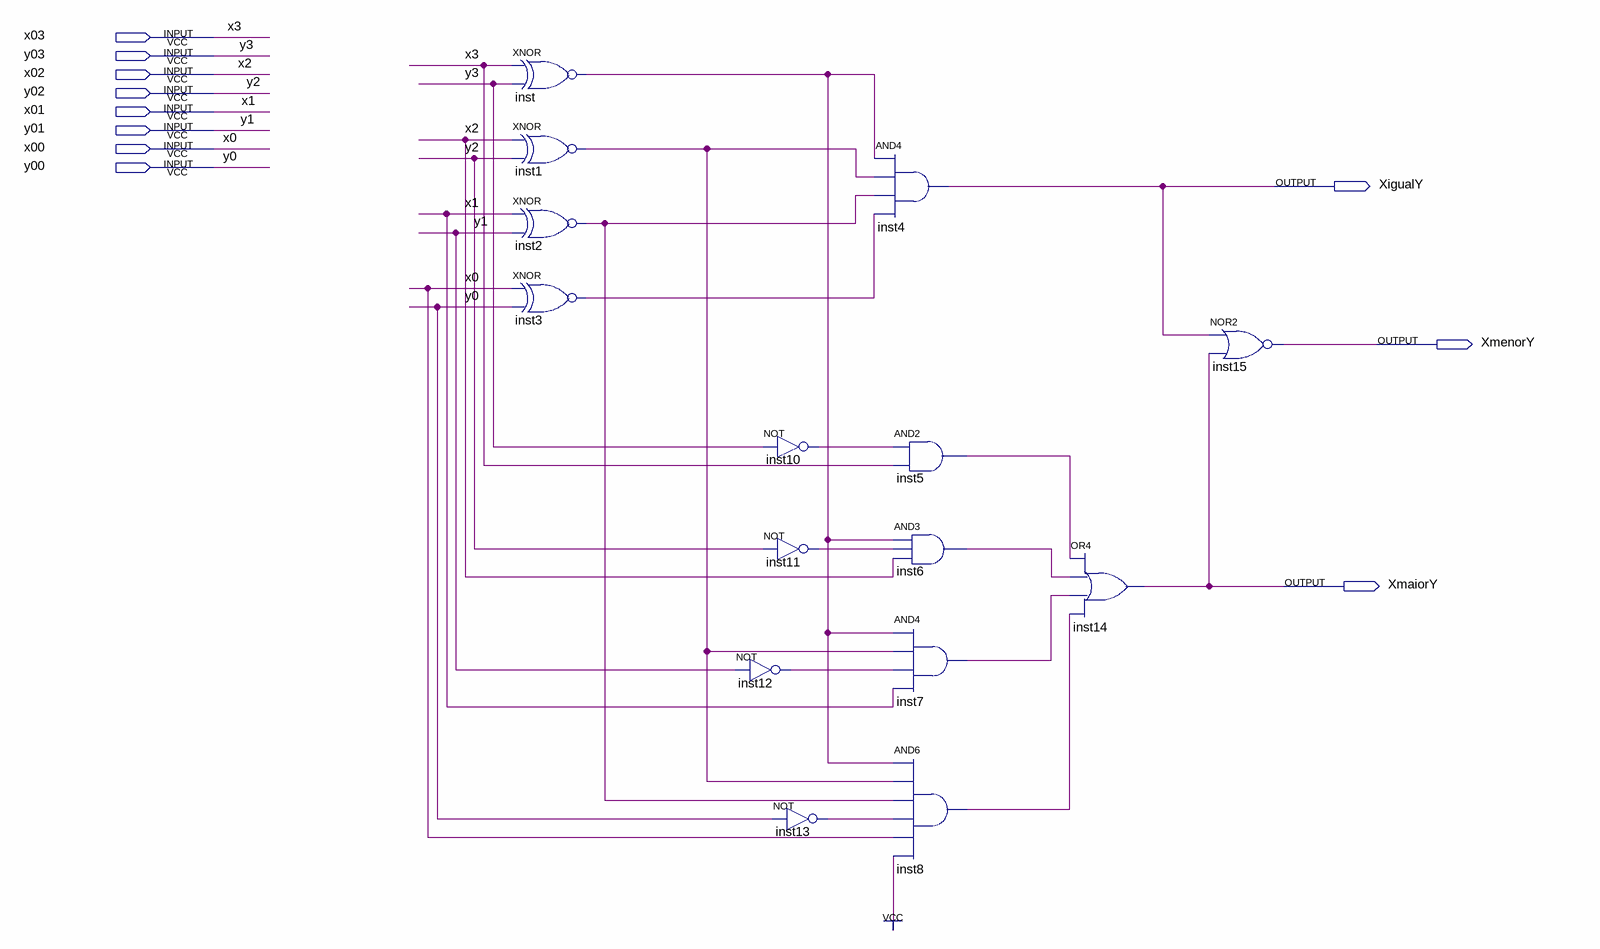
[diagram p0: schematic sheet]
// Quartus schematic comparador.bdf as structural Verilog: 15 symbols, 11 pins
module comparador (
  input  x03,
  input  y03,
  input  x02,
  input  y02,
  input  x01,
  input  y01,
  input  x00,
  input  y00,
  output XigualY,
  output XmenorY,
  output XmaiorY
);

  wire inst1_out, inst2_out, inst3_out, inst5_out, inst6_out, inst7_out, inst8_out, inst10_out, inst11_out,
       inst12_out, inst13_out, inst_out;

  xnor inst (inst_out, x03, y03);
  xnor inst1 (inst1_out, x02, y02);
  xnor inst2 (inst2_out, x01, y01);
  xnor inst3 (inst3_out, x00, y00);
  not inst12 (inst12_out, y01);
  not inst10 (inst10_out, y03);
  not inst11 (inst11_out, y02);
  not inst13 (inst13_out, y00);
  and inst4 (XigualY, inst_out, inst1_out, inst2_out, inst3_out);
  and inst5 (inst5_out, inst10_out, x03);
  and inst6 (inst6_out, inst_out, inst11_out, x02);
  and inst7 (inst7_out, inst_out, inst1_out, inst12_out, x01);
  and inst8 (inst8_out, inst_out, inst1_out, inst2_out, inst13_out, x00, 1'b1);
  or inst14 (XmaiorY, inst5_out, inst6_out, inst7_out, inst8_out);
  nor inst15 (XmenorY, XigualY, XmaiorY);

  // Other names for the same wires on the sheet: x0 = x00; x1 = x01; x2 = x02; x3 = x03; y0 = y00; y1 = y01; y2 = y02;
  //   y3 = y03
endmodule
